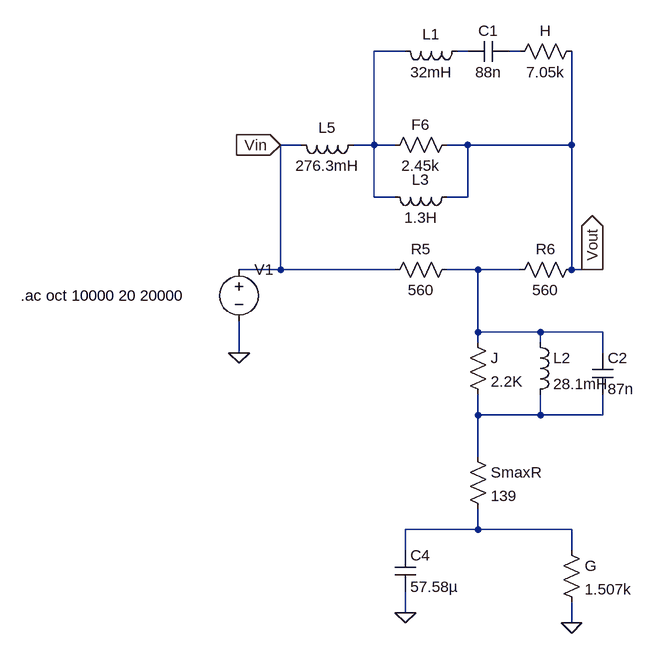
[diagram p0: schematic HiLoBoost.asc]
HiLoBoost.asc, the LTspice schematic file:
Version 4
SHEET 1 880 1104
WIRE 144 208 96 208
WIRE 240 208 224 208
WIRE 320 208 304 208
WIRE -16 352 -48 352
WIRE 96 352 96 208
WIRE 96 352 64 352
WIRE 128 352 96 352
WIRE 240 352 208 352
WIRE 400 352 400 208
WIRE 400 352 240 352
WIRE 96 432 96 352
WIRE 128 432 96 432
WIRE 240 432 240 352
WIRE 240 432 208 432
WIRE -48 544 -48 352
WIRE -48 544 -112 544
WIRE 128 544 -48 544
WIRE 256 544 208 544
WIRE 320 544 256 544
WIRE 400 544 400 352
WIRE 432 544 400 544
WIRE 448 544 432 544
WIRE 256 640 256 544
WIRE 352 640 256 640
WIRE 448 640 352 640
WIRE 256 656 256 640
WIRE 352 656 352 640
WIRE -112 672 -112 624
WIRE 448 672 448 640
WIRE 256 768 256 736
WIRE 352 768 352 736
WIRE 352 768 256 768
WIRE 448 768 448 736
WIRE 448 768 352 768
WIRE 256 832 256 768
WIRE 256 944 256 912
WIRE 256 944 144 944
WIRE 400 944 256 944
WIRE 144 976 144 944
WIRE 400 976 400 944
WIRE 144 1072 144 1040
WIRE 400 1088 400 1056
FLAG 400 1088 0
FLAG 144 1072 0
FLAG -112 672 0
FLAG -48 352 Vin
IOPIN -48 352 In
FLAG 432 544 Vout
IOPIN 432 544 Out
SYMBOL Res 224 336 R90
WINDOW 0 0 56 VBottom 2
WINDOW 3 32 56 VTop 2
SYMATTR InstName F6
SYMATTR Value 2.45k
SYMBOL Res 416 192 R90
WINDOW 0 0 56 VBottom 2
WINDOW 3 32 56 VTop 2
SYMATTR InstName H
SYMATTR Value 7.05k
SYMBOL ind 240 192 R90
WINDOW 0 5 56 VBottom 2
WINDOW 3 32 56 VTop 2
SYMATTR InstName L1
SYMATTR Value 32mH
SYMATTR SpiceLine Rser=6.61
SYMBOL ind 224 416 R90
WINDOW 0 5 56 VBottom 2
WINDOW 3 32 56 VTop 2
SYMATTR InstName L3
SYMATTR Value 1.3H
SYMATTR SpiceLine Rser=233
SYMBOL ind 80 336 R90
WINDOW 0 5 56 VBottom 2
WINDOW 3 32 56 VTop 2
SYMATTR InstName L5
SYMATTR Value 276.3mH
SYMATTR SpiceLine Rser=51.7
SYMBOL Res 224 528 R90
WINDOW 0 0 56 VBottom 2
WINDOW 3 32 56 VTop 2
SYMATTR InstName R5
SYMATTR Value 560
SYMBOL Res 416 528 R90
WINDOW 0 0 56 VBottom 2
WINDOW 3 32 56 VTop 2
SYMATTR InstName R6
SYMATTR Value 560
SYMBOL Cap 304 192 R90
WINDOW 0 0 32 VBottom 2
WINDOW 3 32 32 VTop 2
SYMATTR InstName C1
SYMATTR Value 88n
SYMBOL Res 240 640 R0
SYMATTR InstName J
SYMATTR Value 2.2K
SYMBOL Res 240 816 R0
SYMATTR InstName SmaxR
SYMATTR Value 139
SYMBOL ind 336 640 R0
SYMATTR InstName L2
SYMATTR Value 28.1mH
SYMATTR SpiceLine Rser=6.6
SYMBOL Cap 432 672 R0
SYMATTR InstName C2
SYMATTR Value 87n
SYMBOL Cap 128 976 R0
SYMATTR InstName C4
SYMATTR Value 57.58µ
SYMBOL Res 384 960 R0
SYMATTR InstName G
SYMATTR Value 1.507k
SYMBOL Voltage -112 528 R0
SYMATTR InstName V1
SYMATTR Value ""
SYMATTR Value2 AC 1
TEXT -448 584 Left 2 !.ac oct 10000 20 20000

The netlist it stands for:
* HiLoBoost.asc
R§F6 Vout N001 2.45k
R§H Vout N003 7.05k
L1 N002 N001 32mH Rser=6.61
L3 Vout N001 1.3H Rser=233
L5 N001 Vin 276.3mH Rser=51.7
R5 N004 Vin 560
R6 Vout N004 560
C1 N003 N002 88n
R§J N004 N005 2.2K
R§SmaxR N005 N006 139
L2 N004 N005 28.1mH Rser=6.6
C2 N004 N005 87n
C4 N006 0 57.58µ
R§G N006 0 1.507k
V1 Vin 0 AC 1
.ac oct 10000 20 20000
.backanno
.end